# Altium schematic sheet Measurements and project output.SchDoc
size A4; SheetNumber: 4; SheetTotal: 6
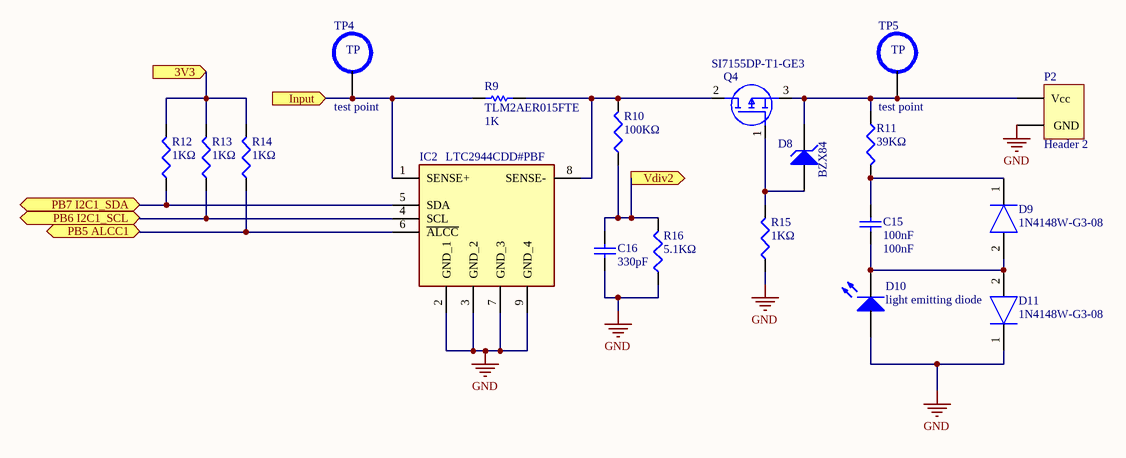
[diagram p0: Measurements and project output.SchDoc]

## Parts
C15  100nF  [CAPC3216X180N]
C16  330pF  [CAPC3216X180N]
D8  BZX84  [SOT95P230X110-3N]
D9  1N4148W-G3-08  [SOD3716X135N]
D10  light emitting diode  [LEDM3216X78N]
D11  1N4148W-G3-08  [SOD3716X135N]
IC2  LTC2944CDD#PBF  [SON50P300X300X80-9N-D]
P2  Header 2  [HDR1X2]
Q4  SI7155DP-T1-GE3  [SI7141DPT1GE3]
R9  TLM2AER015FTE  value 1K  [CAPC2012X94N]
R10  100KΩ  [RESC3216X75N]
R11  39KΩ  [RESC3216X75N]
R12  1KΩ  [RESC3216X75N]
R13  1KΩ  [RESC3216X75N]
R14  1KΩ  [RESC3216X75N]
R15  1KΩ  [RESC3216X75N]
R16  5.1KΩ  [RESC3216X75N]
TP4  test point  [Test point]
TP5  test point  [Test point]

## Ports
3V3 (in), Input (in), PB5 ALCC1 (bidir), PB6 I2C1_SCL (bidir), PB7 I2C1_SDA (bidir), Vdiv2 (out)

## Nets
GND: C16.1 D10.69 D11.1(K) IC2.2(GND_1) IC2.3(GND_2) IC2.7(GND_3) IC2.9(GND_4) P2.?2(GND) R15.1 R16.1
3V3: R12.2 R13.2 R14.2 ; port 3V3
Input: IC2.1(SENSE+) R9.1 TP4.5 ; port Input
PB5 ALCC1: IC2.6(~{ALCC}) R14.1 ; port PB5 ALCC1
PB6 I2C1_SCL: IC2.4(SCL) R13.1 ; port PB6 I2C1_SCL
PB7 I2C1_SDA: IC2.5(SDA) R12.1 ; port PB7 I2C1_SDA
Vdiv2: C16.2 R10.1 R16.2 ; port Vdiv2
NetC15_1: C15.1 D9.1(K) R11.2
NetC15_2: C15.2 D9.2(A) D10.69 D11.2(A)
NetD8_1: D8.1(A) Q4.1(G) R15.2
NetD8_2: D8.2(K) P2.?1(Vcc) Q4.3(S) R11.1 TP5.5
NetIC2_8: IC2.8(SENSE-) Q4.2(D) R9.2 R10.2

## Notes on the sheet
- (in symbol test point) TP

## Library data of the parts
C15 = 100nF: Capacitor; Published: 8-Jun-2000; LatestRevisionDate: 17-Jul-2002; LatestRevisionNote: Re-released for DXP Platform.; PackageReference: RAD-0.3; Publisher: Altium Limited; PackageDescription: Radial Cap, Thru-Hole; 2 Leads; 0.3 in Pin Spacing; Value: 100nF
C16 = 330pF: Capacitor; Published: 8-Jun-2000; LatestRevisionDate: 17-Jul-2002; LatestRevisionNote: Re-released for DXP Platform.; PackageReference: RAD-0.3; Publisher: Altium Limited; PackageDescription: Radial Cap, Thru-Hole; 2 Leads; 0.3 in Pin Spacing; Value: 330pF
D8 = D Zener: Zener Diode / BZX584C6V8-G3-08; Published: 8-Jun-2000; LatestRevisionDate: 17-Jul-2002; LatestRevisionNote: Re-released for DXP Platform.; PackageReference: DIODE-0.7; Publisher: Altium Limited; PackageDescription: Diode, Thru-Hole; 2 Leads; 0.7 in Pin Spacing
D9 D11 = 1N4148W-G3-08: Diode; Manufacturer_Name: Vishay; Datasheet Link: https://componentsearchengine.com/Datasheets/1/1N4148W-G3-08.pdf; Height: 1.35mm; Manufacturer_Part_Number: 1N4148W-G3-08; Mouser Part Number: 78-1N4148W-G3-08; Mouser Price/Stock: https://www.mouser.co.uk/ProductDetail/Vishay-Semiconductors/1N4148W-G3-08?qs=uS%252BVSIFnvp46StDBB15x4Q%3D%3D; Arrow Part Number: 1N4148W-G3-08; Arrow Price/Stock: https://www.arrow.com/en/products/1n4148w-g3-08/vishay
IC2 = LTC2944CDD#PBF: Integrated Circuit; Manufacturer_Name: Analog Devices; Datasheet Link: https://www.analog.com/media/en/technical-documentation/data-sheets/2944fa.pdf; Height: 0.8mm; Manufacturer_Part_Number: LTC2944CDD#PBF; Mouser Part Number: 584-LTC2944CDDPBF; Mouser Price/Stock: https://www.mouser.co.uk/ProductDetail/Analog-Devices/LTC2944CDDPBF?qs=u4fy%2FsgLU9Omd44j%252B6inEQ%3D%3D; Arrow Part Number: LTC2944CDD#PBF; Arrow Price/Stock: https://www.arrow.com/en/products/ltc2944cddpbf/analog-devices
P2 = Header 2: Header, 2-Pin; LatestRevisionDate: 17-Jul-2002; LatestRevisionNote: Re-released for DXP Platform.; Publisher: Altium Limited
Q4 = SI7155DP-T1-GE3: MOSFET (P-Channel)
R9 = Res shunt: Resistor; Published: 8-Jun-2000; LatestRevisionDate: 17-Jul-2002; LatestRevisionNote: Re-released for DXP Platform.; PackageReference: AXIAL-0.3; Publisher: Altium Limited; PackageDescription: Axial Device, Thru-Hole; 2 Leads; 0.3 in Pin Spacing
R10 = 100KΩ: Resistor; Published: 8-Jun-2000; LatestRevisionDate: 29-May-2009; LatestRevisionNote: IPC-7351 Footprint Added.; PackageReference: J1-0603; Publisher: Altium Limited; PackageDescription: Chip Resistor
R11 = 39KΩ: Resistor; Published: 8-Jun-2000; LatestRevisionDate: 29-May-2009; LatestRevisionNote: IPC-7351 Footprint Added.; PackageReference: J1-0603; Publisher: Altium Limited; PackageDescription: Chip Resistor; supplier: farnell
R12-R15 = 1KΩ: Resistor; Published: 8-Jun-2000; LatestRevisionDate: 29-May-2009; LatestRevisionNote: IPC-7351 Footprint Added.; PackageReference: J1-0603; Publisher: Altium Limited; PackageDescription: Chip Resistor; supplier: farnell
R16 = 5.1KΩ: Resistor; Published: 8-Jun-2000; LatestRevisionDate: 29-May-2009; LatestRevisionNote: IPC-7351 Footprint Added.; PackageReference: J1-0603; Publisher: Altium Limited; PackageDescription: Chip Resistor